# Altium schematic sheet AS504D_Sch.SchDoc
size A
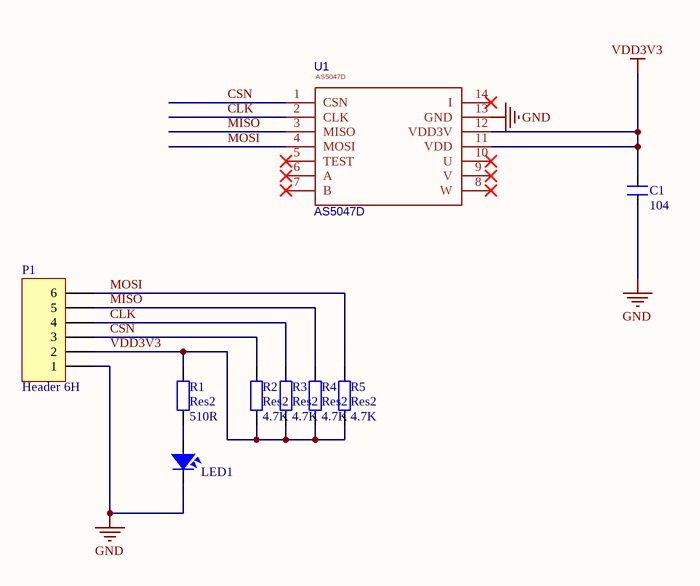
[diagram p0: AS504D_Sch.SchDoc]

## Parts
C1  104  [CN2]
LED1  LED  [LED-3]  (value not drawn)
P1  Header 6H  [HDR1X6H]
R1  Res2  value 510R  [AXIAL-0.4]
R2  Res2  value 4.7K  [AXIAL-0.4]
R3  Res2  value 4.7K  [AXIAL-0.4]
R4  Res2  value 4.7K  [AXIAL-0.4]
R5  Res2  value 4.7K  [AXIAL-0.4]
U1  AS5047D  [TSSOP14]

## Nets
GND: C1.1 LED1.2 P1.1 U1.13(GND)
VDD3V3: C1.2 P1.2 R1.2 R2.2 R3.2 R4.2 R5.2 U1.11(VDD) U1.12(VDD3V)
CLK: P1.4 R3.1 U1.2(CLK)
CSN: P1.3 R2.1 U1.1(CSN)
MISO: P1.5 R4.1 U1.3(MISO)
MOSI: P1.6 R5.1 U1.4(MOSI)
NetLED1_1: LED1.1 R1.1

Not connected (* = marked no-connect by the designer): U1 5(TEST)* 6(A)* 7(B)* 8(W)* 9(V)* 10(U)* 14(I)*

## Library data of the parts
C1 = CN2: Cap np 104 => 105pF; Value: 0.1uF
LED1 = LED: LED Single colour Green and Red; Value: LED 3 ly Single Colour
P1 = Header 6H: Header, 6-Pin, Right Angle; LatestRevisionDate: 17-Jul-2002; LatestRevisionNote: Re-released for DXP Platform.; Publisher: Altium Limited
R1-R5 = Res2: Resistor; Published: 8-Jun-2000; LatestRevisionDate: 17-Jul-2002; LatestRevisionNote: Re-released for DXP Platform.; PackageReference: AXIAL-0.4; Publisher: Altium Limited; PackageDescription: Axial Device, Thru-Hole; 2 Leads; 0.4 in Pin Spacing
U1 = AS5047D: BOM_Manufacturer Part: ?; spicePre: U; Supplier 1: Digi-Key; Supplier Part Number 1: AS5047D-ATSMTR-ND